# Altium project LT6018_breakout.PrjPCB
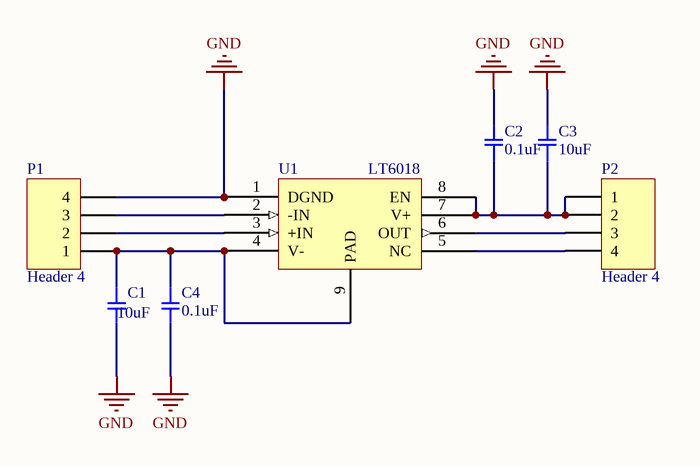
[diagram p0: LT6018_breakout.SchDoc]
1 sheet, 7 parts. Net scope: global (net labels, ports and power ports of the same name join across sheets).
Board files: LT6018_breakout.PcbDoc, panel.PcbDoc

## Sheet LT6018_breakout.SchDoc
size A4

### Parts
C1  10uF  [SMD-0805C]
C2  0.1uF  [SMD-0805C]
C3  10uF  [SMD-0805C]
C4  0.1uF  [SMD-0805C]
P1  Header 4  [HDR1X4]
P2  Header 4  [HDR1X4]
U1  LT6018  [LT6018]

### Nets
GND: C1.2 C2.2 C3.2 C4.2 P1.4 U1.1(DGND)
NetC1_1: C1.1 C4.1 P1.1 U1.4(V-) U1.9(PAD)
NetC2_1: C2.1 C3.1 P2.1 P2.2 U1.7(V+) U1.8(EN)
NetP1_2: P1.2 U1.3(+IN)
NetP1_3: P1.3 U1.2(-IN)
NetP2_3: P2.3 U1.6(OUT)
NetP2_4: P2.4 U1.5(NC)

### Library data of the parts
C1-C4 = GC321AD72E103KX01D: CAP CER 10000PF 250V X7T 0805; Manufacturer: Murata Electronics North America; Factory Stock: 0; Unit Price (USD): 0.3; Minimum Quantity: 1; Tolerance: ±10%; Datasheets: http://search.murata.co.jp/Ceramy/image/img/A01X/G101/ENG/GC321AD72E103KX01-01.pdf; Image: //media.digikey.com/Renders/Murata%20Renders/0805(GC3)200x125.jpg; Digi-Key Part Number: 490-13986-1-ND; Part Number: GC321AD72E103KX01D; Quantity Available: 4000; @ qty: 0; Packaging: Cut Tape (CT); Series: GC3; Part Status: Active; Voltage: 250V; Temperature Coefficient: X7T; Operating Temperature: -55°C ~ 125°C; Features: -; Ratings: AEC-Q200; Applications: Automotive; Mounting Type: Surface Mount, MLCC; Package / Case: 0805 (2012 Metric); Size / Dimension: 0.079" L x 0.049" W (2.00mm x 1.25mm); Height - Seated (Max): -; Thickness (Max): 0.039" (1.00mm); Lead Spacing: -; Lead Style: -
  C1 C3: Value: 10uF
  C2 C4: Value: 0.1uF
P1 P2 = Header 4: Header, 4-Pin; LatestRevisionDate: 17-Jul-2002; LatestRevisionNote: Re-released for DXP Platform.; Publisher: Altium Limited